# Altium schematic sheet PROB_S7CAS_FPGA_1.SchDoc
size Tabloid; SheetNumber: 5; SheetTotal: 15; Sheet_Name: Bank FPGA (1/3); Size: 11x17
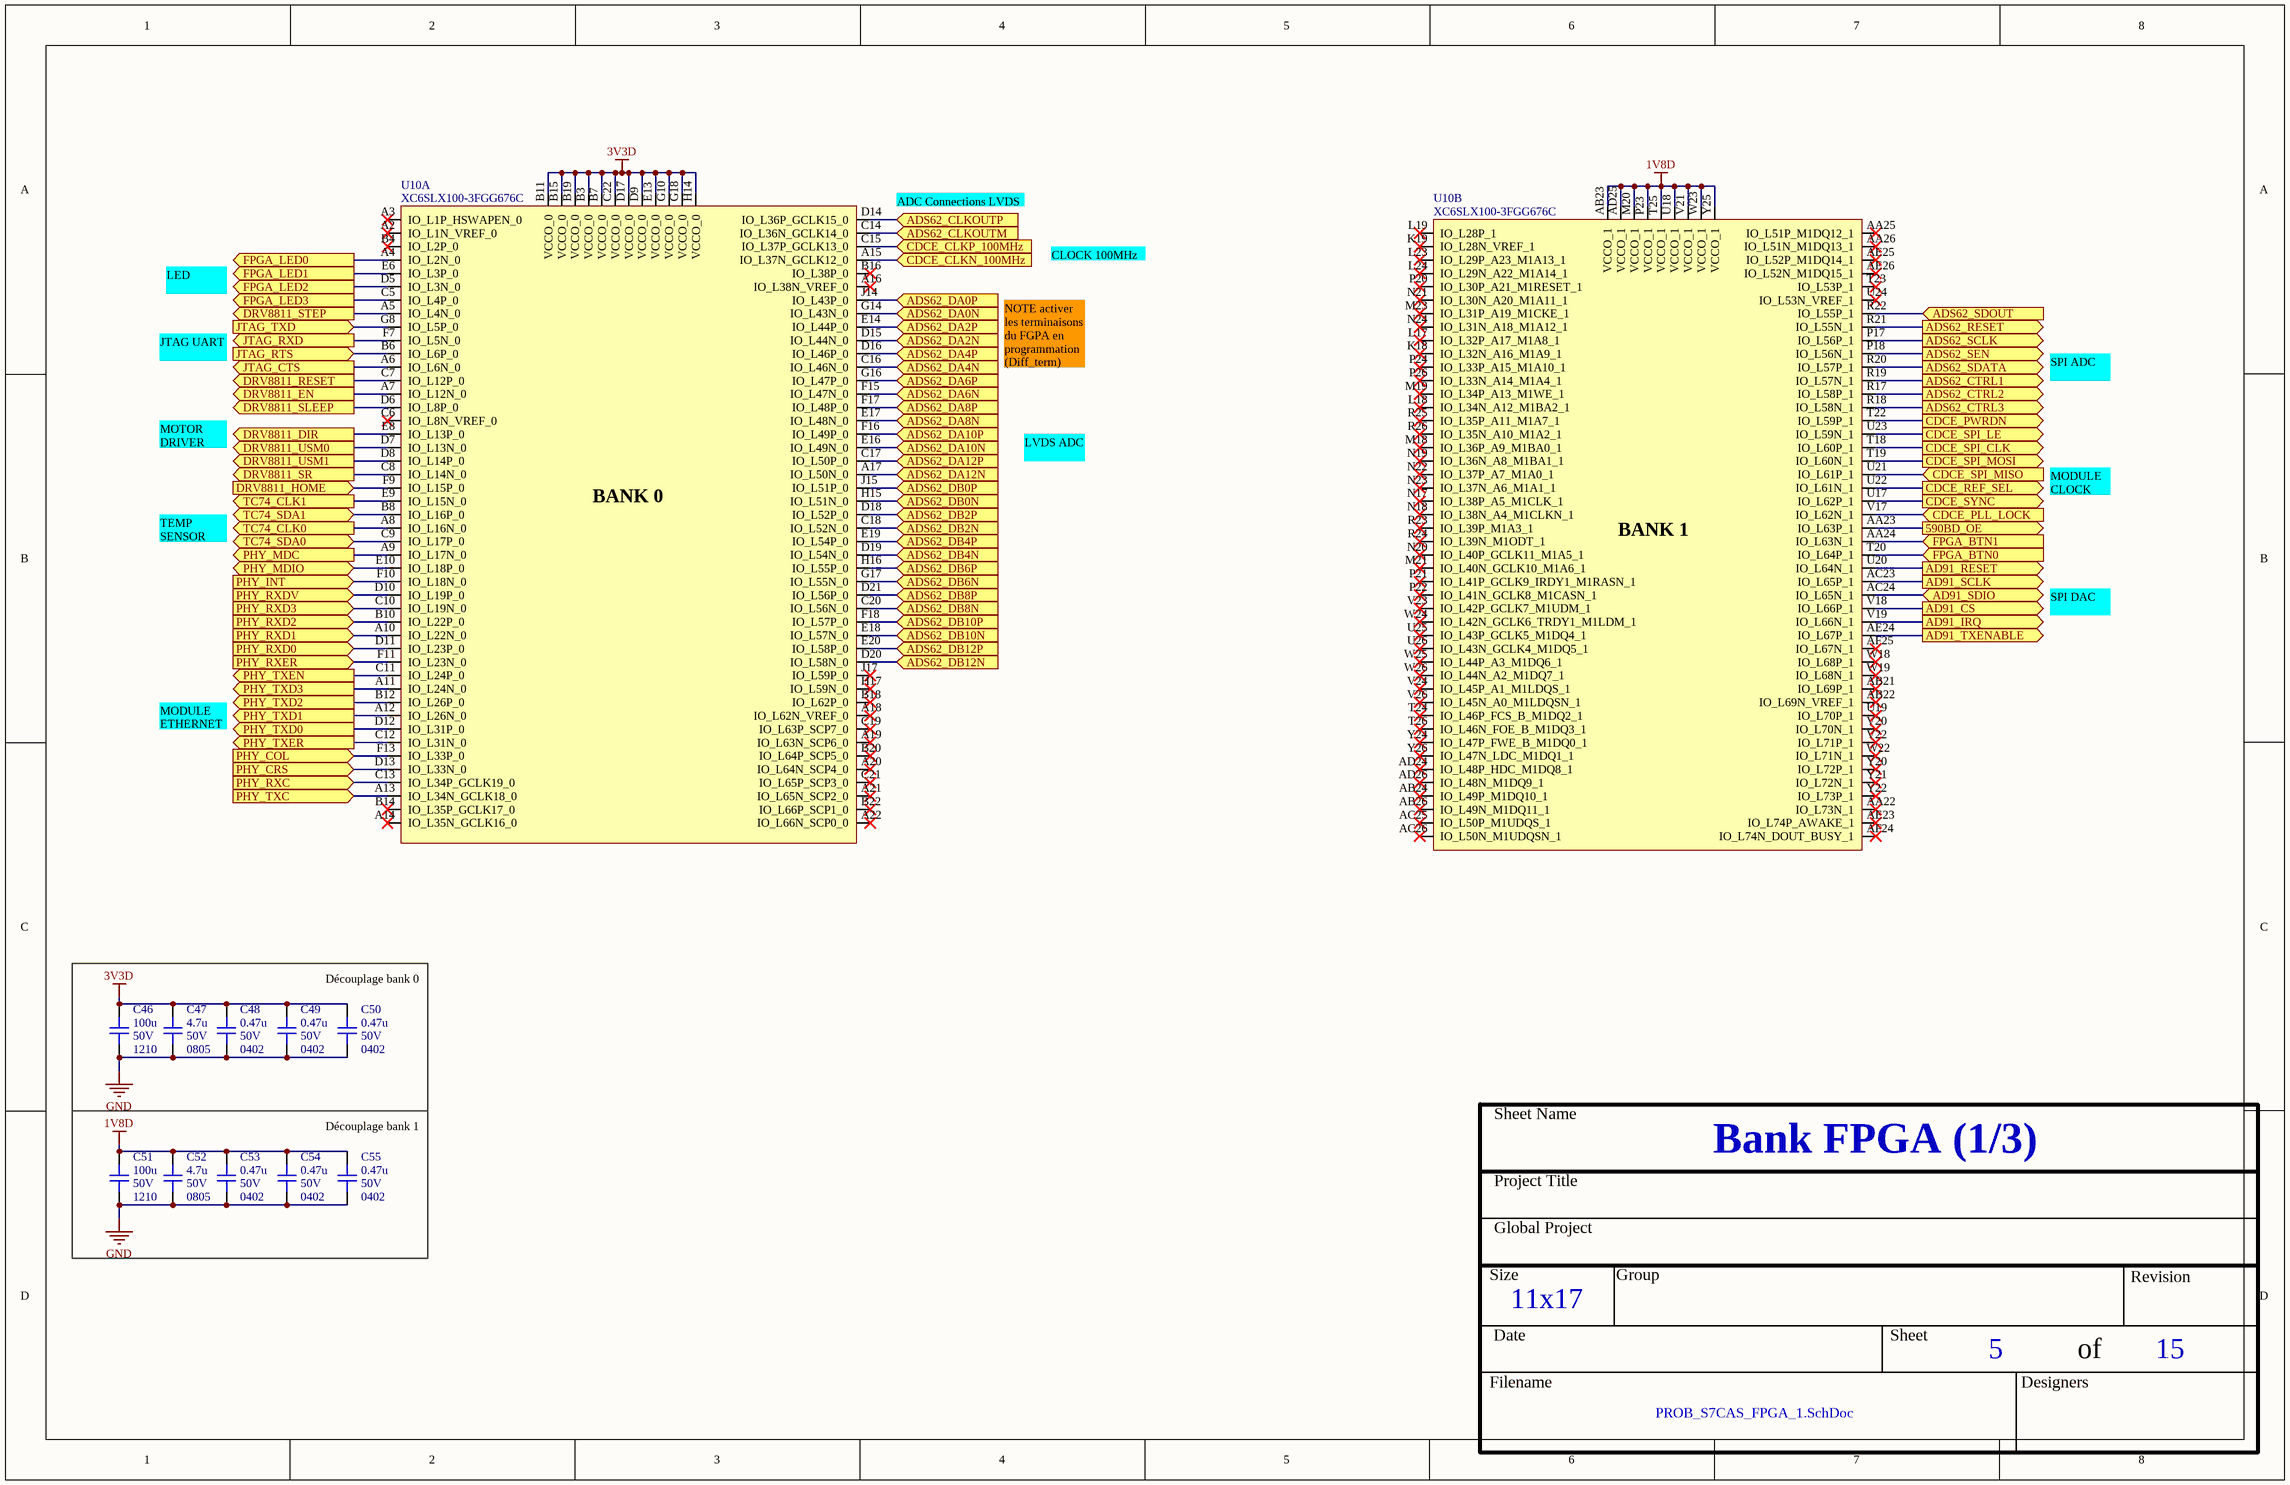
[diagram p0: PROB_S7CAS_FPGA_1.SchDoc]

## Parts
C46  value 100u  Voltage: 50V  Package: 1210  [CAP_1210]  (hidden comment: CAP - 1210)
C47  value 4.7u  Voltage: 50V  Package: 0805  [CAP_0805]  (hidden comment: CAP - 0805)
C48  value 0.47u  Voltage: 50V  Package: 0402  [CAP_0402]  (hidden comment: CAP - 0402)
C49  value 0.47u  Voltage: 50V  Package: 0402  [CAP_0402]  (hidden comment: CAP - 0402)
C50  value 0.47u  Voltage: 50V  Package: 0402  [CAP_0402]  (hidden comment: CAP - 0402)
C51  value 100u  Voltage: 50V  Package: 1210  [CAP_1210]  (hidden comment: CAP - 1210)
C52  value 4.7u  Voltage: 50V  Package: 0805  [CAP_0805]  (hidden comment: CAP - 0805)
C53  value 0.47u  Voltage: 50V  Package: 0402  [CAP_0402]  (hidden comment: CAP - 0402)
C54  value 0.47u  Voltage: 50V  Package: 0402  [CAP_0402]  (hidden comment: CAP - 0402)
C55  value 0.47u  Voltage: 50V  Package: 0402  [CAP_0402]  (hidden comment: CAP - 0402)
U10  XC6SLX100-3FGG676C  [FPGA_XILINX_FGG676]  (parts A,B of 10)

## Ports
590BD_OE (out), AD91_CS (out), AD91_IRQ (out), AD91_RESET (out), AD91_SCLK (out), AD91_SDIO (bidir), AD91_TXENABLE (out), ADS62_CLKOUTM (in), ADS62_CLKOUTP (in), ADS62_CTRL1 (out), ADS62_CTRL2 (out), ADS62_CTRL3 (out), ADS62_DA0N (in), ADS62_DA0P (in), ADS62_DA2N (in), ADS62_DA2P (in), ADS62_DA4N (in), ADS62_DA4P (in), ADS62_DA6N (in), ADS62_DA6P (in), ADS62_DA8N (in), ADS62_DA8P (in), ADS62_DA10N (in), ADS62_DA10P (in), ADS62_DA12N (in), ADS62_DA12P (in), ADS62_DB0N (in), ADS62_DB0P (in), ADS62_DB2N (in), ADS62_DB2P (in), ADS62_DB4N (in), ADS62_DB4P (in), ADS62_DB6N (in), ADS62_DB6P (in), ADS62_DB8N (in), ADS62_DB8P (in), ADS62_DB10N (in), ADS62_DB10P (in), ADS62_DB12N (in), ADS62_DB12P (in), ADS62_RESET (out), ADS62_SCLK (out), ADS62_SDATA (out), ADS62_SDOUT (in), ADS62_SEN (out), CDCE_CLKN_100MHz (in), CDCE_CLKP_100MHz (in), CDCE_PLL_LOCK (in), CDCE_PWRDN (out), CDCE_REF_SEL (out), CDCE_SPI_CLK (out), CDCE_SPI_LE (out), CDCE_SPI_MISO (in), CDCE_SPI_MOSI (out), CDCE_SYNC (out), DRV8811_DIR (out), DRV8811_EN (out), DRV8811_HOME (in), DRV8811_RESET (out), DRV8811_SLEEP (out), DRV8811_SR (out), DRV8811_STEP (out), DRV8811_USM0 (out), DRV8811_USM1 (out), FPGA_BTN0 (in), FPGA_BTN1 (in), FPGA_LED0 (out), FPGA_LED1 (out), FPGA_LED2 (out), FPGA_LED3 (out), JTAG_CTS (out), JTAG_RTS (in), JTAG_RXD (out), JTAG_TXD (in), PHY_COL (in), PHY_CRS (in), PHY_INT (in), PHY_MDC (out), PHY_MDIO (bidir), PHY_RXC (in), PHY_RXD0 (in), PHY_RXD1 (in), PHY_RXD2 (in), PHY_RXD3 (in), PHY_RXDV (in), PHY_RXER (in), PHY_TXC (in), PHY_TXD0 (out), PHY_TXD1 (out), PHY_TXD2 (out), PHY_TXD3 (out), PHY_TXEN (out), PHY_TXER (out), TC74_CLK0 (out), TC74_CLK1 (out), TC74_SDA0 (bidir), TC74_SDA1 (bidir)

## Nets
1V8D: C51.2 C52.2 C53.2 C54.2 C55.2 U10.AB23(VCCO_1) U10.AD25(VCCO_1) U10.M20(VCCO_1) U10.P23(VCCO_1) U10.T25(VCCO_1) U10.U18(VCCO_1) U10.V21(VCCO_1) U10.W23(VCCO_1) U10.Y25(VCCO_1)
3V3D: C46.2 C47.2 C48.2 C49.2 C50.2 U10.B3(VCCO_0) U10.B7(VCCO_0) U10.B11(VCCO_0) U10.B15(VCCO_0) U10.B19(VCCO_0) U10.C22(VCCO_0) U10.D9(VCCO_0) U10.D17(VCCO_0) U10.E13(VCCO_0) U10.G10(VCCO_0) U10.G18(VCCO_0) U10.H14(VCCO_0)
GND: C46.1 C47.1 C48.1 C49.1 C50.1 C51.1 C52.1 C53.1 C54.1 C55.1
590BD_OE: U10.AA23(IO_L63P_1) ; port 590BD_OE
AD91_CS: U10.V18(IO_L66P_1) ; port AD91_CS
AD91_IRQ: U10.V19(IO_L66N_1) ; port AD91_IRQ
AD91_RESET: U10.U20(IO_L64N_1) ; port AD91_RESET
AD91_SCLK: U10.AC23(IO_L65P_1) ; port AD91_SCLK
AD91_SDIO: U10.AC24(IO_L65N_1) ; port AD91_SDIO
AD91_TXENABLE: U10.AE24(IO_L67P_1) ; port AD91_TXENABLE
ADS62_CLKOUTM: U10.C14(IO_L36N_GCLK14_0) ; port ADS62_CLKOUTM
ADS62_CLKOUTP: U10.D14(IO_L36P_GCLK15_0) ; port ADS62_CLKOUTP
ADS62_CTRL1: U10.R19(IO_L57N_1) ; port ADS62_CTRL1
ADS62_CTRL2: U10.R17(IO_L58P_1) ; port ADS62_CTRL2
ADS62_CTRL3: U10.R18(IO_L58N_1) ; port ADS62_CTRL3
ADS62_DA0N: U10.G14(IO_L43N_0) ; port ADS62_DA0N
ADS62_DA0P: U10.J14(IO_L43P_0) ; port ADS62_DA0P
ADS62_DA2N: U10.D15(IO_L44N_0) ; port ADS62_DA2N
ADS62_DA2P: U10.E14(IO_L44P_0) ; port ADS62_DA2P
ADS62_DA4N: U10.C16(IO_L46N_0) ; port ADS62_DA4N
ADS62_DA4P: U10.D16(IO_L46P_0) ; port ADS62_DA4P
ADS62_DA6N: U10.F15(IO_L47N_0) ; port ADS62_DA6N
ADS62_DA6P: U10.G16(IO_L47P_0) ; port ADS62_DA6P
ADS62_DA8N: U10.E17(IO_L48N_0) ; port ADS62_DA8N
ADS62_DA8P: U10.F17(IO_L48P_0) ; port ADS62_DA8P
ADS62_DA10N: U10.E16(IO_L49N_0) ; port ADS62_DA10N
ADS62_DA10P: U10.F16(IO_L49P_0) ; port ADS62_DA10P
ADS62_DA12N: U10.A17(IO_L50N_0) ; port ADS62_DA12N
ADS62_DA12P: U10.C17(IO_L50P_0) ; port ADS62_DA12P
ADS62_DB0N: U10.H15(IO_L51N_0) ; port ADS62_DB0N
ADS62_DB0P: U10.J15(IO_L51P_0) ; port ADS62_DB0P
ADS62_DB2N: U10.C18(IO_L52N_0) ; port ADS62_DB2N
ADS62_DB2P: U10.D18(IO_L52P_0) ; port ADS62_DB2P
ADS62_DB4N: U10.D19(IO_L54N_0) ; port ADS62_DB4N
ADS62_DB4P: U10.E19(IO_L54P_0) ; port ADS62_DB4P
ADS62_DB6N: U10.G17(IO_L55N_0) ; port ADS62_DB6N
ADS62_DB6P: U10.H16(IO_L55P_0) ; port ADS62_DB6P
ADS62_DB8N: U10.C20(IO_L56N_0) ; port ADS62_DB8N
ADS62_DB8P: U10.D21(IO_L56P_0) ; port ADS62_DB8P
ADS62_DB10N: U10.E18(IO_L57N_0) ; port ADS62_DB10N
ADS62_DB10P: U10.F18(IO_L57P_0) ; port ADS62_DB10P
ADS62_DB12N: U10.D20(IO_L58N_0) ; port ADS62_DB12N
ADS62_DB12P: U10.E20(IO_L58P_0) ; port ADS62_DB12P
ADS62_RESET: U10.R21(IO_L55N_1) ; port ADS62_RESET
ADS62_SCLK: U10.P17(IO_L56P_1) ; port ADS62_SCLK
ADS62_SDATA: U10.R20(IO_L57P_1) ; port ADS62_SDATA
ADS62_SDOUT: U10.R22(IO_L55P_1) ; port ADS62_SDOUT
ADS62_SEN: U10.P18(IO_L56N_1) ; port ADS62_SEN
CDCE_CLKN_100MHz: U10.A15(IO_L37N_GCLK12_0) ; port CDCE_CLKN_100MHz
CDCE_CLKP_100MHz: U10.C15(IO_L37P_GCLK13_0) ; port CDCE_CLKP_100MHz
CDCE_PLL_LOCK: U10.V17(IO_L62N_1) ; port CDCE_PLL_LOCK
CDCE_PWRDN: U10.T22(IO_L59P_1) ; port CDCE_PWRDN
CDCE_REF_SEL: U10.U22(IO_L61N_1) ; port CDCE_REF_SEL
CDCE_SPI_CLK: U10.T18(IO_L60P_1) ; port CDCE_SPI_CLK
CDCE_SPI_LE: U10.U23(IO_L59N_1) ; port CDCE_SPI_LE
CDCE_SPI_MISO: U10.U21(IO_L61P_1) ; port CDCE_SPI_MISO
CDCE_SPI_MOSI: U10.T19(IO_L60N_1) ; port CDCE_SPI_MOSI
CDCE_SYNC: U10.U17(IO_L62P_1) ; port CDCE_SYNC
DRV8811_DIR: U10.E8(IO_L13P_0) ; port DRV8811_DIR
DRV8811_EN: U10.A7(IO_L12N_0) ; port DRV8811_EN
DRV8811_HOME: U10.F9(IO_L15P_0) ; port DRV8811_HOME
DRV8811_RESET: U10.C7(IO_L12P_0) ; port DRV8811_RESET
DRV8811_SLEEP: U10.D6(IO_L8P_0) ; port DRV8811_SLEEP
DRV8811_SR: U10.C8(IO_L14N_0) ; port DRV8811_SR
DRV8811_STEP: U10.A5(IO_L4N_0) ; port DRV8811_STEP
DRV8811_USM0: U10.D7(IO_L13N_0) ; port DRV8811_USM0
DRV8811_USM1: U10.D8(IO_L14P_0) ; port DRV8811_USM1
FPGA_BTN0: U10.T20(IO_L64P_1) ; port FPGA_BTN0
FPGA_BTN1: U10.AA24(IO_L63N_1) ; port FPGA_BTN1
FPGA_LED0: U10.A4(IO_L2N_0) ; port FPGA_LED0
FPGA_LED1: U10.E6(IO_L3P_0) ; port FPGA_LED1
FPGA_LED2: U10.D5(IO_L3N_0) ; port FPGA_LED2
FPGA_LED3: U10.C5(IO_L4P_0) ; port FPGA_LED3
JTAG_CTS: U10.A6(IO_L6N_0) ; port JTAG_CTS
JTAG_RTS: U10.B6(IO_L6P_0) ; port JTAG_RTS
JTAG_RXD: U10.F7(IO_L5N_0) ; port JTAG_RXD
JTAG_TXD: U10.G8(IO_L5P_0) ; port JTAG_TXD
PHY_COL: U10.F13(IO_L33P_0) ; port PHY_COL
PHY_CRS: U10.D13(IO_L33N_0) ; port PHY_CRS
PHY_INT: U10.F10(IO_L18N_0) ; port PHY_INT
PHY_MDC: U10.A9(IO_L17N_0) ; port PHY_MDC
PHY_MDIO: U10.E10(IO_L18P_0) ; port PHY_MDIO
PHY_RXC: U10.C13(IO_L34P_GCLK19_0) ; port PHY_RXC
PHY_RXD0: U10.D11(IO_L23P_0) ; port PHY_RXD0
PHY_RXD1: U10.A10(IO_L22N_0) ; port PHY_RXD1
PHY_RXD2: U10.B10(IO_L22P_0) ; port PHY_RXD2
PHY_RXD3: U10.C10(IO_L19N_0) ; port PHY_RXD3
PHY_RXDV: U10.D10(IO_L19P_0) ; port PHY_RXDV
PHY_RXER: U10.F11(IO_L23N_0) ; port PHY_RXER
PHY_TXC: U10.A13(IO_L34N_GCLK18_0) ; port PHY_TXC
PHY_TXD0: U10.D12(IO_L31P_0) ; port PHY_TXD0
PHY_TXD1: U10.A12(IO_L26N_0) ; port PHY_TXD1
PHY_TXD2: U10.B12(IO_L26P_0) ; port PHY_TXD2
PHY_TXD3: U10.A11(IO_L24N_0) ; port PHY_TXD3
PHY_TXEN: U10.C11(IO_L24P_0) ; port PHY_TXEN
PHY_TXER: U10.C12(IO_L31N_0) ; port PHY_TXER
TC74_CLK0: U10.A8(IO_L16N_0) ; port TC74_CLK0
TC74_CLK1: U10.E9(IO_L15N_0) ; port TC74_CLK1
TC74_SDA0: U10.C9(IO_L17P_0) ; port TC74_SDA0
TC74_SDA1: U10.B8(IO_L16P_0) ; port TC74_SDA1

Not connected (* = marked no-connect by the designer): U10 A2(IO_L1N_VREF_0)* A3(IO_L1P_HSWAPEN_0)* A14(IO_L35N_GCLK16_0)* A16(IO_L38N_VREF_0)* A18(IO_L62N_VREF_0)* A19(IO_L63N_SCP6_0)* A20(IO_L64N_SCP4_0)* A21(IO_L65N_SCP2_0)* A22(IO_L66N_SCP0_0)* AA22(IO_L73N_1)* AA25(IO_L51P_M1DQ12_1)* AA26(IO_L51N_M1DQ13_1)* AB21(IO_L69P_1)* AB22(IO_L69N_VREF_1)* AB24(IO_L49P_M1DQ10_1)* AB26(IO_L49N_M1DQ11_1)* AC25(IO_L50P_M1UDQS_1)* AC26(IO_L50N_M1UDQSN_1)* AD24(IO_L48P_HDC_M1DQ8_1)* AD26(IO_L48N_M1DQ9_1)* AE23(IO_L74P_AWAKE_1)* AE25(IO_L52P_M1DQ14_1)* AE26(IO_L52N_M1DQ15_1)* AF24(IO_L74N_DOUT_BUSY_1)* AF25(IO_L67N_1)* B4(IO_L2P_0)* B14(IO_L35P_GCLK17_0)* B16(IO_L38P_0)* B18(IO_L62P_0)* B20(IO_L64P_SCP5_0)* B22(IO_L66P_SCP1_0)* C6(IO_L8N_VREF_0)* C19(IO_L63P_SCP7_0)* C21(IO_L65P_SCP3_0)* H17(IO_L59N_0)* J17(IO_L59P_0)* K18(IO_L32N_A16_M1A9_1)* K19(IO_L28N_VREF_1)* L17(IO_L32P_A17_M1A8_1)* L18(IO_L34N_A12_M1BA2_1)* L19(IO_L28P_1)* L23(IO_L29P_A23_M1A13_1)* L24(IO_L29N_A22_M1A14_1)* M18(IO_L36P_A9_M1BA0_1)* M19(IO_L34P_A13_M1WE_1)* M21(IO_L40N_GCLK10_M1A6_1)* M23(IO_L31P_A19_M1CKE_1)* N17(IO_L38P_A5_M1CLK_1)* N18(IO_L38N_A4_M1CLKN_1)* N19(IO_L36N_A8_M1BA1_1)* N20(IO_L40P_GCLK11_M1A5_1)* N21(IO_L30N_A20_M1A11_1)* N22(IO_L37P_A7_M1A0_1)* N23(IO_L37N_A6_M1A1_1)* N24(IO_L31N_A18_M1A12_1)* P20(IO_L30P_A21_M1RESET_1)* P21(IO_L41P_GCLK9_IRDY1_M1RASN_1)* P22(IO_L41N_GCLK8_M1CASN_1)* P24(IO_L33P_A15_M1A10_1)* P26(IO_L33N_A14_M1A4_1)* R23(IO_L39P_M1A3_1)* R24(IO_L39N_M1ODT_1)* R25(IO_L35P_A11_M1A7_1)* R26(IO_L35N_A10_M1A2_1)* T23(IO_L53P_1)* T24(IO_L46P_FCS_B_M1DQ2_1)* T26(IO_L46N_FOE_B_M1DQ3_1)* U19(IO_L70P_1)* U24(IO_L53N_VREF_1)* U25(IO_L43P_GCLK5_M1DQ4_1)* U26(IO_L43N_GCLK4_M1DQ5_1)* V20(IO_L70N_1)* V22(IO_L71P_1)* V23(IO_L42P_GCLK7_M1UDM_1)* V24(IO_L45P_A1_M1LDQS_1)* V26(IO_L45N_A0_M1LDQSN_1)* W18(IO_L68P_1)* W19(IO_L68N_1)* W22(IO_L71N_1)* W24(IO_L42N_GCLK6_TRDY1_M1LDM_1)* W25(IO_L44P_A3_M1DQ6_1)* W26(IO_L44N_A2_M1DQ7_1)* Y20(IO_L72P_1)* Y21(IO_L72N_1)* Y22(IO_L73P_1)* Y24(IO_L47P_FWE_B_M1DQ0_1)* Y26(IO_L47N_LDC_M1DQ1_1)*

## Notes on the sheet
- (near U10) ADC Connections LVDS
- LED
- CLOCK 100MHz
- JTAG UART
- NOTE activer les terminaisons du FGPA en programmation (Diff_term)
- SPI ADC
- MOTOR DRIVER
- LVDS ADC
- MODULE CLOCK
- TEMP SENSOR
- SPI DAC
- MODULE ETHERNET
- Découplage bank 0
- Découplage bank 1
- Sheet Name
- Project Title
- Global Project
- Size
- Group
- Revision
- Date
- Sheet
- of
- Filename
- Designers
- (in symbol FPGA_XC6SLX100-3FGG676C, part A) BANK 0
- (in symbol FPGA_XC6SLX100-3FGG676C, part B) BANK 1

## Library data of the parts
C46 C51 = CAP - 1210: Precision: 10%; Current: *; CreatedBy: Jonathan Bouchard
C47 C52 = CAP - 0805: Precision: 10%; Current: *; CreatedBy: Jonathan Bouchard; Power: *
C48-C50 C53-C55 = CAP - 0402: Precision: 10%; Current: *; CreatedBy: Jonathan Bouchard; Power: *
U10 = FPGA_XC6SLX100-3FGG676C: FPGA - XILINX SPARTAN 6 480 I/O - BGA-676; Voltage: 1.14 V ~ 1.26 V; Current: *; Power: *; Mfg: Xilinx; Mfg Part Number: XC6SLX100-3FGG676C; HelpURL: https://www.xilinx.com/support/documentation/data_sheets/ds162.pdf; CreatedBy: Jonathan Bouchard; Temperature: 0°C ~ 85°C (TJ); Value: *; Precision: *; Package: BGA-676; Supplier 1: Digikey; Supplier Part Number 1: 122-1760-ND